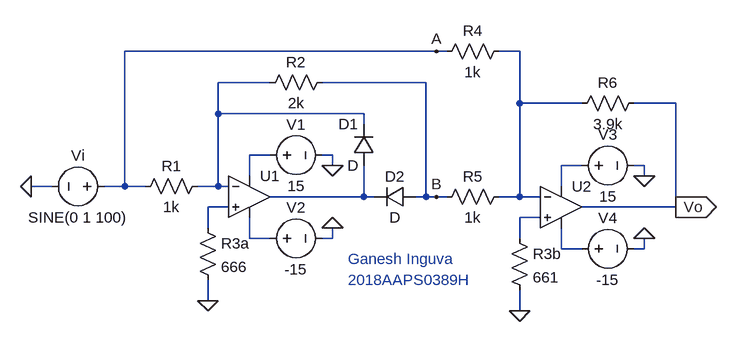
[diagram p0: schematic Run_2.asc]
Run_2.asc, the LTspice schematic file:
Version 4
SHEET 1 880 680
WIRE 384 -80 -96 -80
WIRE 400 -80 384 -80
WIRE 512 -80 480 -80
WIRE 128 -32 48 -32
WIRE 368 -32 208 -32
WIRE 512 0 512 -80
WIRE 608 0 512 0
WIRE 752 0 688 0
WIRE 48 16 48 -32
WIRE 272 16 48 16
WIRE 272 32 272 16
WIRE 128 80 96 80
WIRE 224 80 208 80
WIRE 224 96 224 80
WIRE 608 96 576 96
WIRE 704 96 688 96
WIRE 96 112 96 80
WIRE 704 112 704 96
WIRE -208 128 -240 128
WIRE -96 128 -96 -80
WIRE -96 128 -128 128
WIRE -64 128 -96 128
WIRE 48 128 48 16
WIRE 48 128 16 128
WIRE 64 128 48 128
WIRE 576 128 576 96
WIRE 272 144 272 96
WIRE 272 144 128 144
WIRE 288 144 272 144
WIRE 368 144 368 -32
WIRE 368 144 352 144
WIRE 384 144 368 144
WIRE 400 144 384 144
WIRE 512 144 512 0
WIRE 512 144 480 144
WIRE 544 144 512 144
WIRE 64 160 32 160
WIRE 752 160 752 0
WIRE 752 160 608 160
WIRE 544 176 512 176
WIRE 32 192 32 160
WIRE 96 208 96 176
WIRE 128 208 96 208
WIRE 224 208 224 192
WIRE 224 208 208 208
WIRE 512 208 512 176
WIRE 576 224 576 192
WIRE 608 224 576 224
WIRE 704 224 704 208
WIRE 704 224 688 224
WIRE 32 304 32 272
WIRE 512 320 512 288
FLAG 224 192 0
FLAG 224 96 0
FLAG 32 304 0
FLAG -240 128 0
FLAG 704 208 0
FLAG 704 112 0
FLAG 512 320 0
FLAG 752 160 Vo
IOPIN 752 160 Out
FLAG 384 -80 A
FLAG 384 144 B
SYMBOL OpAmps\\UniversalOpamp2 96 144 R0
SYMATTR InstName U1
SYMBOL voltage 112 80 R270
WINDOW 0 32 56 VTop 2
WINDOW 3 -32 56 VBottom 2
WINDOW 123 0 0 Left 0
WINDOW 39 0 0 Left 0
SYMATTR InstName V1
SYMATTR Value 15
SYMBOL voltage 112 208 R270
WINDOW 0 32 56 VTop 2
WINDOW 3 -32 56 VBottom 2
WINDOW 123 0 0 Left 0
WINDOW 39 0 0 Left 0
SYMATTR InstName V2
SYMATTR Value -15
SYMBOL diode 288 96 R180
WINDOW 0 24 64 Left 2
WINDOW 3 24 0 Left 2
SYMATTR InstName D1
SYMBOL diode 352 128 R90
WINDOW 0 0 32 VBottom 2
WINDOW 3 32 32 VTop 2
SYMATTR InstName D2
SYMBOL res 224 -48 R90
WINDOW 0 0 56 VBottom 2
WINDOW 3 32 56 VTop 2
SYMATTR InstName R2
SYMATTR Value 2k
SYMBOL res 496 128 R90
WINDOW 0 0 56 VBottom 2
WINDOW 3 32 56 VTop 2
SYMATTR InstName R5
SYMATTR Value 1k
SYMBOL res 32 112 R90
WINDOW 0 0 56 VBottom 2
WINDOW 3 32 56 VTop 2
SYMATTR InstName R1
SYMATTR Value 1k
SYMBOL res 496 -96 R90
WINDOW 0 0 56 VBottom 2
WINDOW 3 32 56 VTop 2
SYMATTR InstName R4
SYMATTR Value 1k
SYMBOL res 16 176 R0
SYMATTR InstName R3a
SYMATTR Value 666
SYMBOL voltage -112 128 R90
WINDOW 0 -32 56 VBottom 2
WINDOW 3 32 56 VTop 2
WINDOW 123 0 0 Left 0
WINDOW 39 0 0 Left 0
SYMATTR InstName Vi
SYMATTR Value SINE(0 1 100)
SYMBOL OpAmps\\UniversalOpamp2 576 160 R0
SYMATTR InstName U2
SYMBOL voltage 592 96 R270
WINDOW 0 32 56 VTop 2
WINDOW 3 -32 56 VBottom 2
WINDOW 123 0 0 Left 0
WINDOW 39 0 0 Left 0
SYMATTR InstName V3
SYMATTR Value 15
SYMBOL voltage 592 224 R270
WINDOW 0 32 56 VTop 2
WINDOW 3 -32 56 VBottom 2
WINDOW 123 0 0 Left 0
WINDOW 39 0 0 Left 0
SYMATTR InstName V4
SYMATTR Value -15
SYMBOL res 496 192 R0
SYMATTR InstName R3b
SYMATTR Value 661
SYMBOL res 704 -16 R90
WINDOW 0 0 56 VBottom 2
WINDOW 3 32 56 VTop 2
SYMATTR InstName R6
SYMATTR Value 3.9k
TEXT 248 240 Left 2 ;Ganesh Inguva
TEXT 248 272 Left 2 ;2018AAPS0389H

The netlist it stands for:
* Run_2.asc
XU1 N006 N002 N003 N008 N005 level.2 Avol=1Meg GBW=10Meg Slew=10Meg ilimit=25m rail=0 Vos=0 phimargin=45 en=0 enk=0 in=0 ink=0 Rin=500Meg  ; pins IN+ IN- V+ V- OUT
V1 N003 0 15
V2 N008 0 -15
D1 N005 N002 D
D2 B N005 D
R2 B N002 2k
R5 N001 B 1k
R1 N002 A 1k
R4 N001 A 1k
R3a N006 0 666
Vi A 0 SINE(0 1 100)
XU2 N007 N001 N004 N009 Vo level.2 Avol=1Meg GBW=10Meg Slew=10Meg ilimit=25m rail=0 Vos=0 phimargin=45 en=0 enk=0 in=0 ink=0 Rin=500Meg  ; pins IN+ IN- V+ V- OUT
V3 N004 0 15
V4 N009 0 -15
R3b N007 0 661
R6 Vo N001 3.9k
.model D D
.lib standard.dio
* Ganesh Inguva
* 2018AAPS0389H
.lib UniversalOpamps2.sub
.backanno
.end